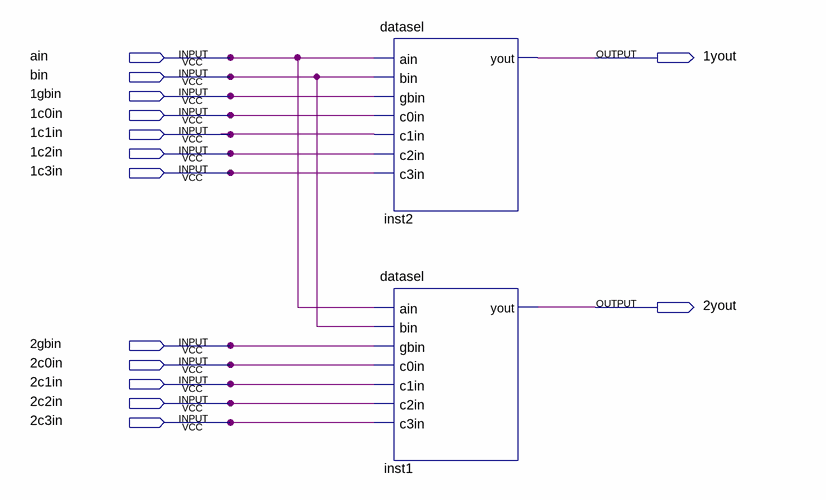
[diagram p0: schematic sheet]
// Quartus schematic hc153.bdf as structural Verilog: 2 symbols, 14 pins
module hc153 (
  input  ain,
  input  bin,
  input  \1gbin ,
  input  \1c0in ,
  input  \1c1in ,
  input  \1c2in ,
  input  \1c3in ,
  input  \2gbin ,
  input  \2c0in ,
  input  \2c1in ,
  input  \2c2in ,
  input  \2c3in ,
  output \1yout ,
  output \2yout 
);

  datasel inst2 (
    .ain(ain), .bin(bin), .gbin(\1gbin ), .c0in(\1c0in ), .c1in(\1c1in ), .c2in(\1c2in ), .c3in(\1c3in ),
    .yout(\1yout ));
  datasel inst1 (
    .ain(ain), .bin(bin), .gbin(\2gbin ), .c0in(\2c0in ), .c1in(\2c1in ), .c2in(\2c2in ), .c3in(\2c3in ),
    .yout(\2yout ));
endmodule
